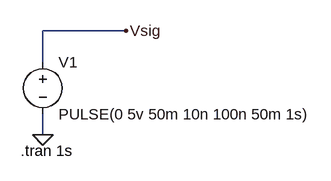
[diagram p0: schematic 1.9.2.asc]
1.9.2.asc, the LTspice schematic file:
Version 4
SHEET 1 880 680
WIRE 192 80 64 80
WIRE 64 128 64 80
WIRE 64 240 64 208
FLAG 64 240 0
FLAG 192 80 Vsig
SYMBOL voltage 64 112 R0
WINDOW 123 0 0 Left 0
WINDOW 39 0 0 Left 0
SYMATTR InstName V1
SYMATTR Value PULSE(0 5v 50m 10n 100n 50m 1s)
TEXT 30 264 Left 2 !.tran 1s

The netlist it stands for:
* 1.9.2.asc
V1 Vsig 0 PULSE(0 5v 50m 10n 100n 50m 1s)
.tran 1s
.backanno
.end